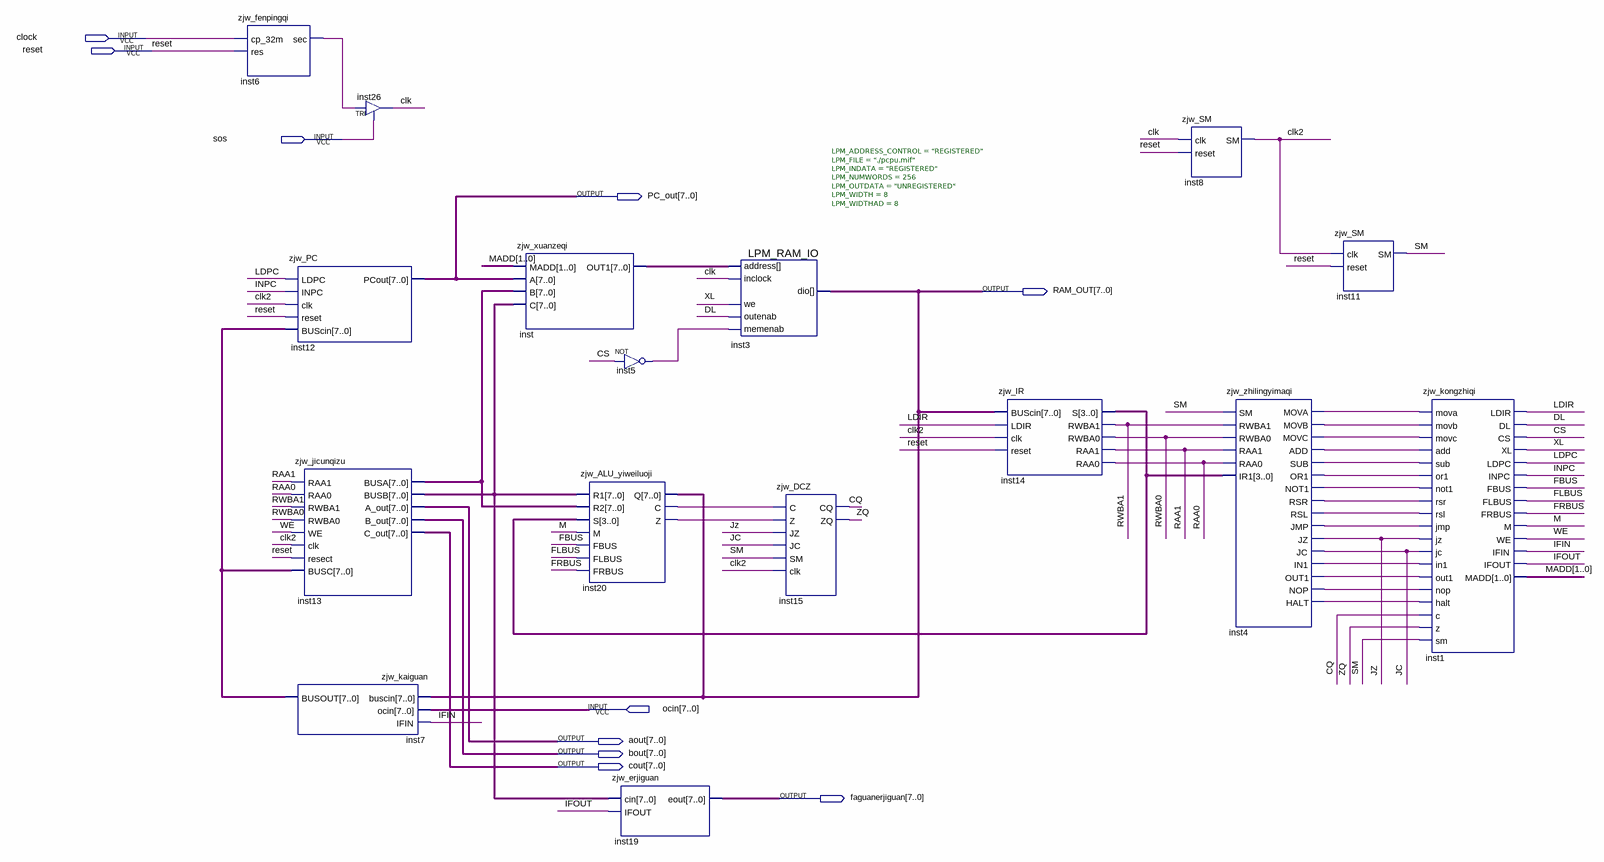
[diagram p0: schematic sheet]
// Quartus schematic pcpu.bdf as structural Verilog: 16 symbols, 10 pins
module pcpu (
  input  clock,
  input  reset,
  input  sos,
  input  [7:0] ocin,
  output [7:0] PC_out,
  output [7:0] RAM_OUT,
  output [7:0] aout,
  output [7:0] bout,
  output [7:0] cout,
  output [7:0] faguanerjiguan
);

  wire clk, clk2, CQ, CS, DL, FBUS, FLBUS, FRBUS, IFIN, IFOUT, INPC, inst4_add, inst4_halt, inst4_in1,
       inst4_jmp, inst4_mova, inst4_movb, inst4_movc, inst4_nop, inst4_not1, inst4_or1, inst4_out1,
       inst4_rsl, inst4_rsr, inst4_sub, inst5_out, inst6_sec, inst20_c, inst20_z, JC, JZ, LDIR, LDPC, M,
       RAA0, RAA1, RWBA0, RWBA1, SM, WE, XL, ZQ;
  wire [1:0] MADD;
  wire [3:0] inst14_s;
  wire [7:0] inst7_busout, inst13_busa, inst13_busb, inst_out1;

  zjw_fenpingqi inst6 (.cp_32m(clock), .res(reset), .sec(inst6_sec));
  zjw_PC inst12 (.LDPC(LDPC), .INPC(INPC), .clk(clk2), .reset(reset), .BUScin(inst7_busout), .PCout(PC_out));
  zjw_jicunqizu inst13 (
    .RAA1(RAA1), .RAA0(RAA0), .RWBA1(RWBA1), .RWBA0(RWBA0), .WE(WE), .clk(clk2), .resect(reset),
    .BUSC(inst7_busout), .BUSA(inst13_busa), .BUSB(inst13_busb), .A_out(aout), .B_out(bout), .C_out(cout));
  zjw_kaiguan inst7 (.buscin(RAM_OUT), .ocin(ocin), .IFIN(IFIN), .BUSOUT(inst7_busout));
  TRI inst26 (.IN(inst6_sec), .OE(sos), .OUT(clk));
  zjw_xuanzeqi inst (.MADD(MADD), .A(PC_out), .B(inst13_busa), .C(inst13_busb), .OUT1(inst_out1));
  zjw_ALU_yiweiluoji inst20 (
    .R1(inst13_busb), .R2(inst13_busa), .S(inst14_s), .M(M), .FBUS(FBUS), .FLBUS(FLBUS), .FRBUS(FRBUS),
    .Q(RAM_OUT), .C(inst20_c), .Z(inst20_z));
  not inst5 (inst5_out, CS);
  zjw_erjiguan inst19 (.cin(inst13_busb), .IFOUT(IFOUT), .eout(faguanerjiguan));
  LPM_RAM_IO #(.LPM_ADDRESS_CONTROL("REGISTERED"), .LPM_FILE("./pcpu.mif"), .LPM_INDATA("REGISTERED"), .LPM_NUMWORDS(256), .LPM_OUTDATA("UNREGISTERED"), .LPM_WIDTH(8), .LPM_WIDTHAD(8)) inst3 (
    .address(inst_out1), .memenab(inst5_out), .inclock(clk), .we(XL), .outenab(DL), .dio(RAM_OUT));
  zjw_DCZ inst15 (.C(inst20_c), .Z(inst20_z), .JZ(JZ), .JC(JC), .SM(SM), .clk(clk2), .CQ(CQ), .ZQ(ZQ));
  zjw_IR inst14 (
    .BUScin(RAM_OUT), .LDIR(LDIR), .clk(clk2), .reset(reset), .S(inst14_s), .RWBA1(RWBA1), .RWBA0(RWBA0),
    .RAA1(RAA1), .RAA0(RAA0));
  zjw_SM inst8 (.clk(clk), .reset(reset), .SM(clk2));
  zjw_zhilingyimaqi inst4 (
    .SM(SM), .RWBA1(RWBA1), .RWBA0(RWBA0), .RAA1(RAA1), .RAA0(RAA0), .IR1(inst14_s), .MOVA(inst4_mova),
    .MOVB(inst4_movb), .MOVC(inst4_movc), .ADD(inst4_add), .SUB(inst4_sub), .OR1(inst4_or1),
    .NOT1(inst4_not1), .RSR(inst4_rsr), .RSL(inst4_rsl), .JMP(inst4_jmp), .JZ(JZ), .JC(JC), .IN1(inst4_in1),
    .OUT1(inst4_out1), .NOP(inst4_nop), .HALT(inst4_halt));
  zjw_SM inst11 (.clk(clk2), .reset(reset), .SM(SM));
  zjw_kongzhiqi inst1 (
    .mova(inst4_mova), .movb(inst4_movb), .movc(inst4_movc), .add(inst4_add), .sub(inst4_sub),
    .or1(inst4_or1), .not1(inst4_not1), .rsr(inst4_rsr), .rsl(inst4_rsl), .jmp(inst4_jmp), .jz(JZ), .jc(JC),
    .in1(inst4_in1), .out1(inst4_out1), .nop(inst4_nop), .halt(inst4_halt), .c(CQ), .z(ZQ), .sm(SM),
    .LDIR(LDIR), .DL(DL), .CS(CS), .XL(XL), .LDPC(LDPC), .INPC(INPC), .FBUS(FBUS), .FLBUS(FLBUS),
    .FRBUS(FRBUS), .M(M), .WE(WE), .IFIN(IFIN), .IFOUT(IFOUT), .MADD(MADD));
endmodule
